# Altium schematic sheet Sensors.SchDoc: Sensors
size A3; SheetNumber: 4; SheetTotal: 4
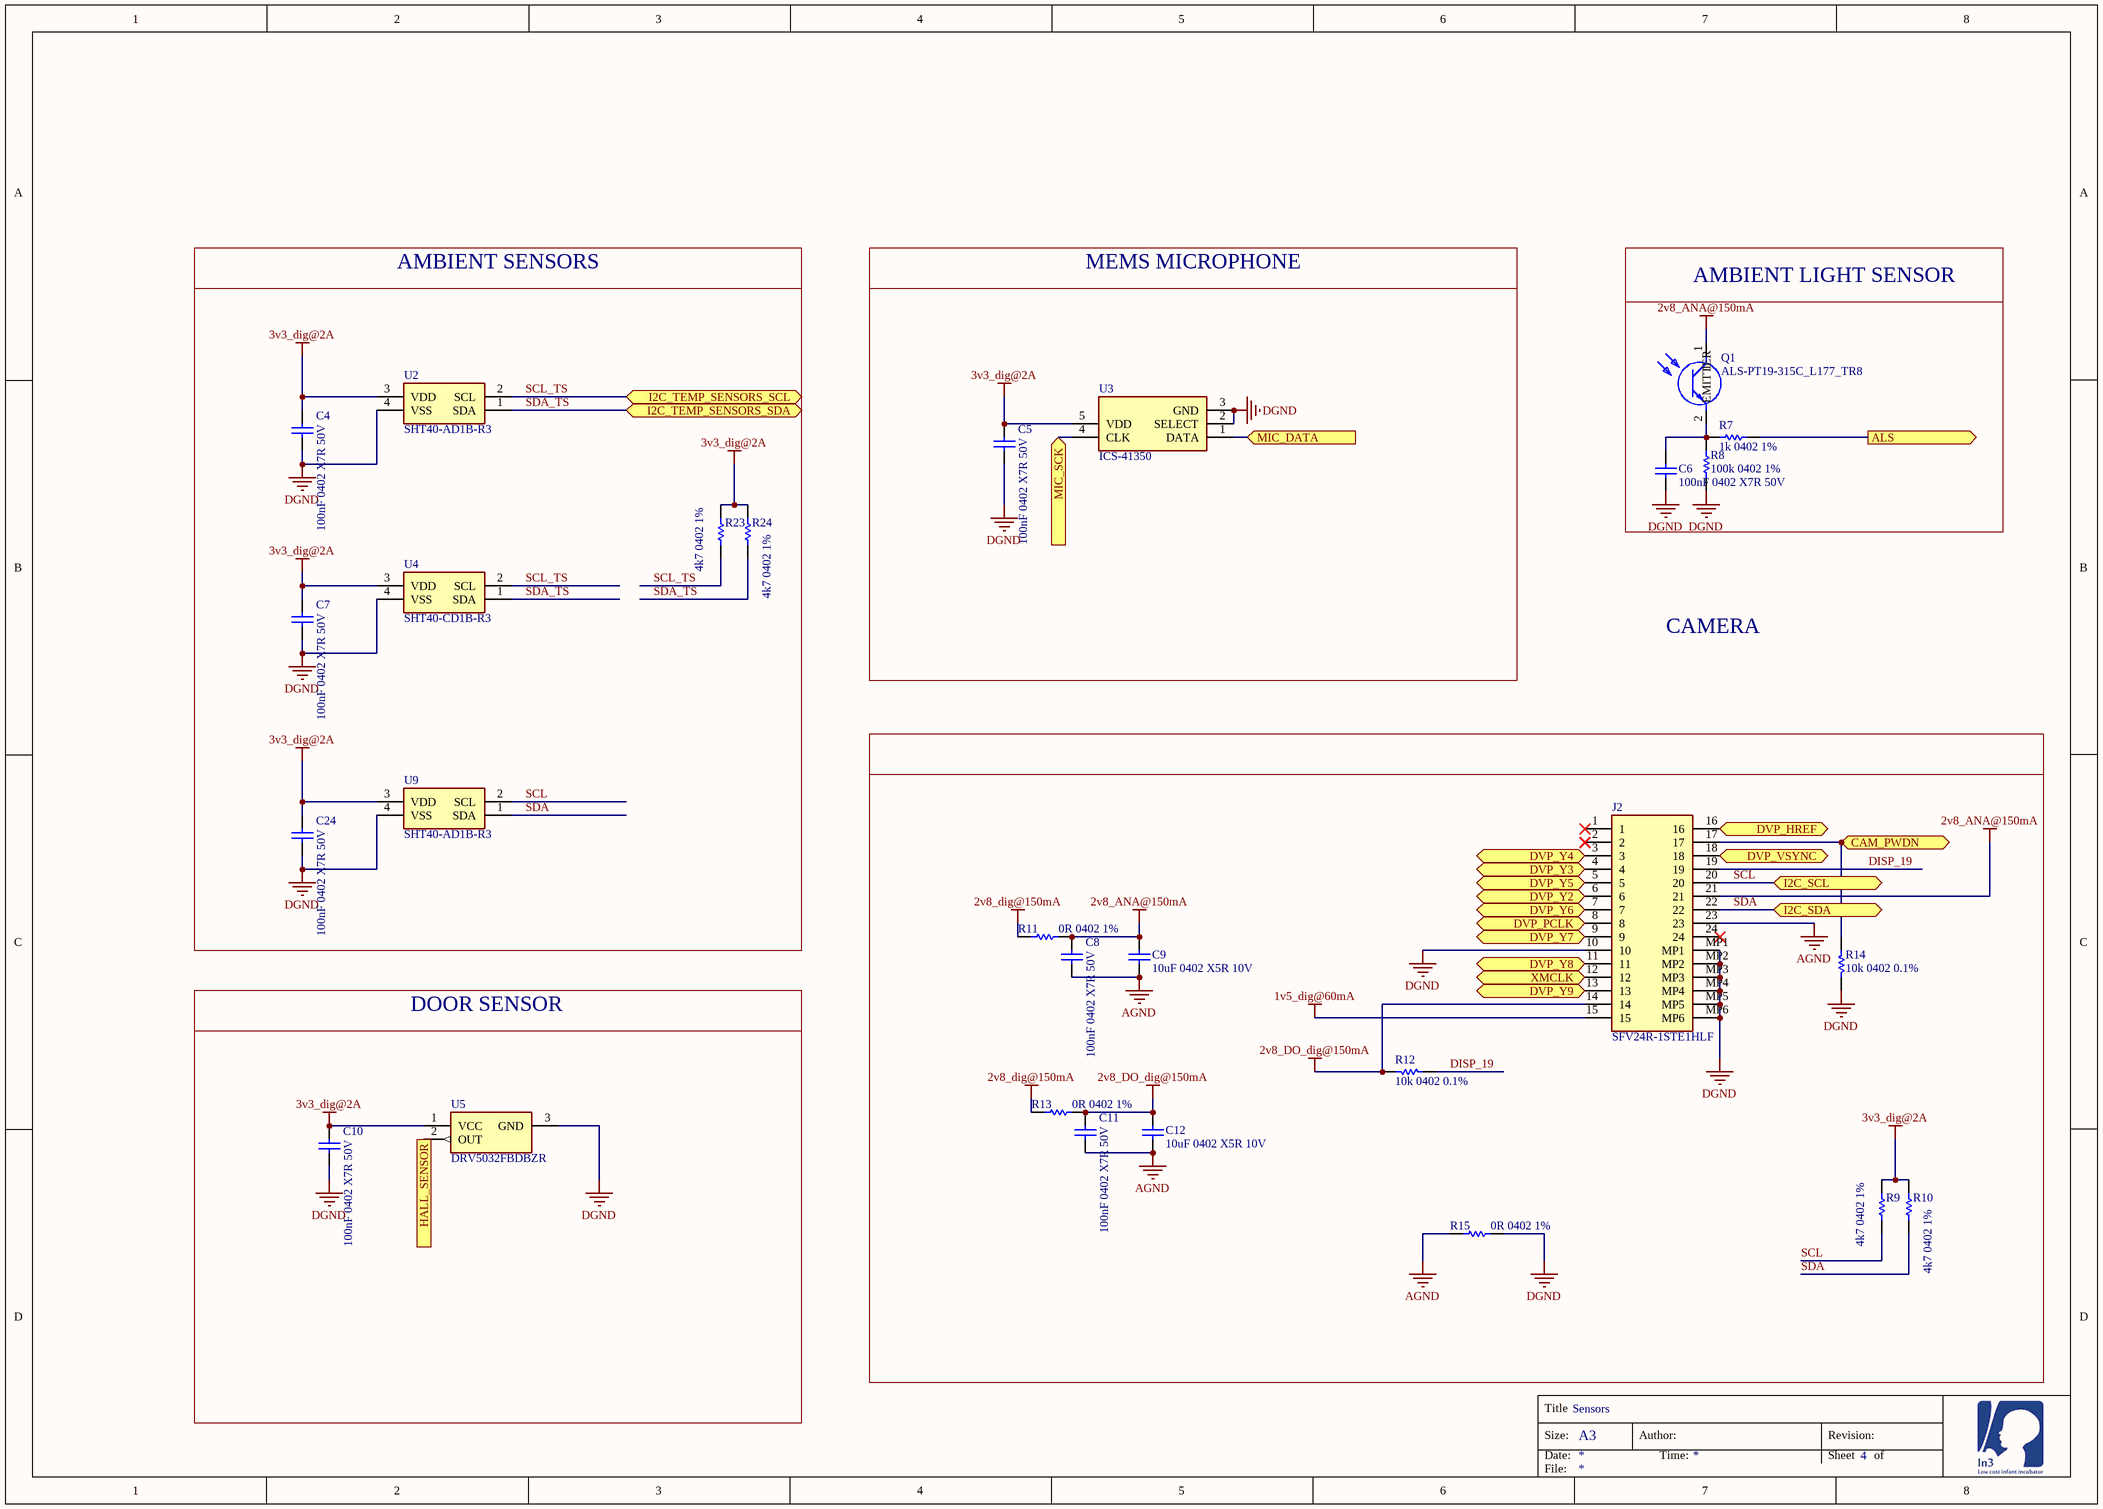
[diagram p0: Sensors.SchDoc]

## Parts
C4  100nF 0402 X7R 50V  [CAPC1005X55X25NL5T10]
C5  100nF 0402 X7R 50V  [CAPC1005X55X25NL5T10]
C6  100nF 0402 X7R 50V  [CAPC1005X55X25NL5T10]
C7  100nF 0402 X7R 50V  [CAPC1005X55X25NL5T10]
C8  100nF 0402 X7R 50V  [CAPC1005X55X25NL5T10]
C9  10uF 0402 X5R 10V  [CAPC1005X55X25NL5T10]
C10  100nF 0402 X7R 50V  [CAPC1005X55X25NL5T10]
C11  100nF 0402 X7R 50V  [CAPC1005X55X25NL5T10]
C12  10uF 0402 X5R 10V  [CAPC1005X55X25NL5T10]
C24  100nF 0402 X7R 50V  [CAPC1005X55X25NL5T10]
J2  SFV24R-1STE1HLF  [SFV24R1STE1HLF]
Q1  ALS-PT19-315C_L177_TR8  [ALSPT19315CL177TR8]
R7  1k 0402 1%  [RESC1005X40X25ML05T10]
R8  100k 0402 1%  [RESC1005X40X25ML05T10]
R9  4k7 0402 1%  [RESC1005X40X25ML05T10]
R10  4k7 0402 1%  [RESC1005X40X25ML05T10]
R11  0R 0402 1%  [RESC1005X40X25ML05T10]
R12  10k 0402 0.1%  [RESC1005X40X25ML05T10]
R13  0R 0402 1%  [RESC1005X40X25ML05T10]
R14  10k 0402 0.1%  [RESC1005X40X25ML05T10]
R15  0R 0402 1%  [RESC1005X40X25ML05T10]
R23  4k7 0402 1%  [RESC1005X40X25ML05T10]
R24  4k7 0402 1%  [RESC1005X40X25ML05T10]
U2  SHT40-AD1B-R3  [SHT40AD1BR3]
U3  ICS-41350  [ICS41352]
U4  SHT40-CD1B-R3  [SHT40CD1BR3]
U5  DRV5032FBDBZR  [SOT95P237X95-3N]
U9  SHT40-AD1B-R3  [SHT40AD1BR3]

## Blocks framed on the sheet
AMBIENT SENSORS: C4 C7 C24 R23 R24 U2 U4 U9
MEMS MICROPHONE: C5 U3
AMBIENT LIGHT SENSOR: C6 Q1 R7 R8
DOOR SENSOR: C10 U5

## Ports
ALS (out), CAM_PWDN (bidir), DVP_HREF (bidir), DVP_PCLK (bidir), DVP_VSYNC (bidir), DVP_Y2 (bidir), DVP_Y3 (bidir), DVP_Y4 (bidir), DVP_Y5 (bidir), DVP_Y6 (bidir), DVP_Y7 (bidir), DVP_Y8 (bidir), DVP_Y9 (bidir), HALL_SENSOR (out), I2C_SCL (bidir), I2C_SDA (bidir), I2C_TEMP_SENSORS_SCL (bidir), I2C_TEMP_SENSORS_SDA (bidir), MIC_DATA (in), MIC_SCK (in), XMCLK (bidir)

## Nets
1v5_dig@60mA: J2.15
2v8_ANA@150mA: C8.2 C9.1 J2.21 Q1.1 R11.1
2v8_dig@150mA: R11.2 R13.2
2v8_DO_dig@150mA: C11.2 C12.1 J2.14 R12.2 R13.1
3v3_dig@2A: C4.2 C5.2 C7.2 C10.2 C24.2 R9.1 R10.1 R23.1 R24.1 U2.3(VDD) U3.5(VDD) U4.3(VDD) U5.1(VCC) U9.3(VDD)
AGND: C8.1 C9.2 C11.1 C12.2 J2.23 R15.2
DGND: C4.1 C5.1 C6.2 C7.1 C10.1 C24.1 J2.10 J2.MP1 J2.MP2 J2.MP3 J2.MP4 J2.MP5 J2.MP6 R8.2 R14.2 R15.1 U2.4(VSS) U3.2(SELECT) U3.3(GND) U4.4(VSS) U5.3(GND) U9.4(VSS)
ALS: R7.2 ; port ALS
CAM_PWDN: J2.17 R14.1 ; port CAM_PWDN
DISP_19: J2.19 R12.1
DVP_HREF: J2.16 ; port DVP_HREF
DVP_PCLK: J2.8 ; port DVP_PCLK
DVP_VSYNC: J2.18 ; port DVP_VSYNC
DVP_Y2: J2.6 ; port DVP_Y2
DVP_Y3: J2.4 ; port DVP_Y3
DVP_Y4: J2.3 ; port DVP_Y4
DVP_Y5: J2.5 ; port DVP_Y5
DVP_Y6: J2.7 ; port DVP_Y6
DVP_Y7: J2.9 ; port DVP_Y7
DVP_Y8: J2.11 ; port DVP_Y8
DVP_Y9: J2.13 ; port DVP_Y9
HALL_SENSOR: U5.2(OUT) ; port HALL_SENSOR
MIC_DATA: U3.1(DATA) ; port MIC_DATA
MIC_SCK: U3.4(CLK) ; port MIC_SCK
SCL: J2.20 R9.2 U9.2(SCL) ; port I2C_SCL
SCL_TS: R23.2 U2.2(SCL) U4.2(SCL) ; port I2C_TEMP_SENSORS_SCL
SDA: J2.22 R10.2 U9.1(SDA) ; port I2C_SDA
SDA_TS: R24.2 U2.1(SDA) U4.1(SDA) ; port I2C_TEMP_SENSORS_SDA
XMCLK: J2.12 ; port XMCLK
NetC6_1: C6.1 Q1.2(EMITTER) R7.1 R8.1

Not connected (* = marked no-connect by the designer): J2 1* 2* 24*

## Notes on the sheet
- CAMERA
- Title
- Size:
- Date:
- A3
- Author:
- Time:
- Revision:
- Sheet
- of
- File:

## Library data of the parts
C4-C12 C24 = CMP-1662-00020-1: ComponentLink2Description: Datasheet; ComponentLink2URL: http://psearch.en.murata.com/capacitor/product/GRM155R60J105KE19%23.pdf; ComponentLink1Description: Manufacturer URL; ComponentLink1URL: http://www.murata.com/
  C4-C8 C10 C11 C24: LCSC_PN: C77020
  C9 C12: LCSC_PN: C77000
J2 = SFV24R-1STE1HLF: Connector; Manufacturer_Name: Amphenol Communications Solutions; Datasheet Link: https://cdn.amphenol-cs.com/media/wysiwyg/files/drawing/10112793.pdf; Height: 2mm; Manufacturer_Part_Number: SFV24R-1STE1HLF; LCSC_PN: C599469
Q1 = ALS-PT19-315C_L177_TR8: Phototransistor; Manufacturer_Name: Everlight; Manufacturer_Part_Number: ALS-PT19-315C/L177/TR8; Datasheet Link: https://www.digikey.ph/en/products/detail/everlight-electronics-co-ltd/ALS-PT19-315C-L177-TR8/2675735?srsltid=AfmBOopkZAWRkSRGF2QkCTJg8jlOMXuDkqdJQuZk5-RcBTTXcrGGKyht; Height: 0mm; Mouser Part Number: 638-ALSPT19315CL177; Mouser Price/Stock: https://www.mouser.co.uk/ProductDetail/Everlight/ALS-PT19-315C-L177-TR8?qs=8PzhAHr7IdN7OeHhwLrtPw%3D%3D; Arrow Part Number: ALS-PT19-315C/L177/TR8; Arrow Price/Stock: https://www.arrow.com/en/products/als-pt19-315cl177tr8/everlight-electronics?utm_currency=USD&region=europe; LCSC_PN: C146233
R7-R15 R23 R24 = CMP-2002-07472-1
  R7: LCSC_PN: C106235
  R8: LCSC_PN: C60491
  R9 R10 R23 R24: LCSC_PN: C105871
  R11 R13 R15: LCSC_PN: C60485
  R12 R14: LCSC_PN: C190095
U2 U9 = SHT40-AD1B-R3: Integrated Circuit; Manufacturer_Name: Sensirion; Datasheet Link: https://www.arrow.com/en/products/sht40-ad1b-r3/sensirion-ag; Height: 0.59mm; Manufacturer_Part_Number: SHT40-AD1B-R3; Mouser Part Number: 403-SHT40-AD1B-R3; Mouser Price/Stock: https://www.mouser.co.uk/ProductDetail/Sensirion/SHT40-AD1B-R3?qs=zW32dvEIR3sa7U6cFW6pBw%3D%3D; Arrow Part Number: SHT40-AD1B-R3; Arrow Price/Stock: https://www.arrow.com/en/products/sht40-ad1b-r3/sensirion-ag?utm_currency=USD&region=asia; LCSC_PN: C2848306
U3 = ICS-41350: Integrated Circuit; Manufacturer_Name: TDK; Datasheet Link: https://product.tdk.com/system/files/dam/doc/product/sw_piezo/mic/mems-mic/data_sheet/ds-000048-ics-41352-data-sheet-v1.0.pdf; Height: 1.13mm; Manufacturer_Part_Number: ICS-41350; Mouser Part Number: 410-ICS-41350; Mouser Price/Stock: https://www.mouser.co.uk/ProductDetail/TDK-InvenSense/ICS-41350?qs=u4fy%2FsgLU9MU%252BiFhvX73lg%3D%3D; Arrow Part Number: ICS-41350; Arrow Price/Stock: https://www.arrow.com/en/products/ics-41350/invensense.html?utm_currency=USD&region=nac; LCSC_PN: C3171856
U4 = SHT40-CD1B-R3: Integrated Circuit; Manufacturer_Name: Sensirion; Datasheet Link: https://sensirion.com/media/documents/33FD6951/6555C40E/Sensirion_Datasheet_SHT4x.pdf; Height: 0.59mm; Manufacturer_Part_Number: SHT40-CD1B-R3; Mouser Part Number: 403-SHT40-CD1B-R3; Mouser Price/Stock: https://www.mouser.co.uk/ProductDetail/Sensirion/SHT40-CD1B-R3?qs=ulEaXIWI0c%2FeyXO6eo5KrQ%3D%3D; Arrow Part Number: SHT40-CD1B-R3; Arrow Price/Stock: https://www.arrow.com/en/products/sht40-cd1b-r3/sensirion-ag?utm_currency=USD&region=nac; LCSC_PN: C7461852
U5 = DRV5032FBDBZR: Integrated Circuit; Manufacturer_Name: Texas Instruments; Datasheet Link: http://www.ti.com/lit/gpn/drv5032; Height: 0.95mm; Manufacturer_Part_Number: DRV5032FBDBZR; Mouser Part Number: 595-DRV5032FBDBZR; Mouser Price/Stock: https://www.mouser.co.uk/ProductDetail/Texas-Instruments/DRV5032FBDBZR?qs=u4fy%2FsgLU9MVJlgotSzybA%3D%3D; Arrow Part Number: DRV5032FBDBZR; Arrow Price/Stock: https://www.arrow.com/en/products/drv5032fbdbzr/texas-instruments?region=nac; LCSC_PN: C2655033